# EAGLE design impulse (EAGLE 6.4)
AUTHOR: Brad Campbell; REV: B; TITLE: Impulse

## Sheet 1 of 2
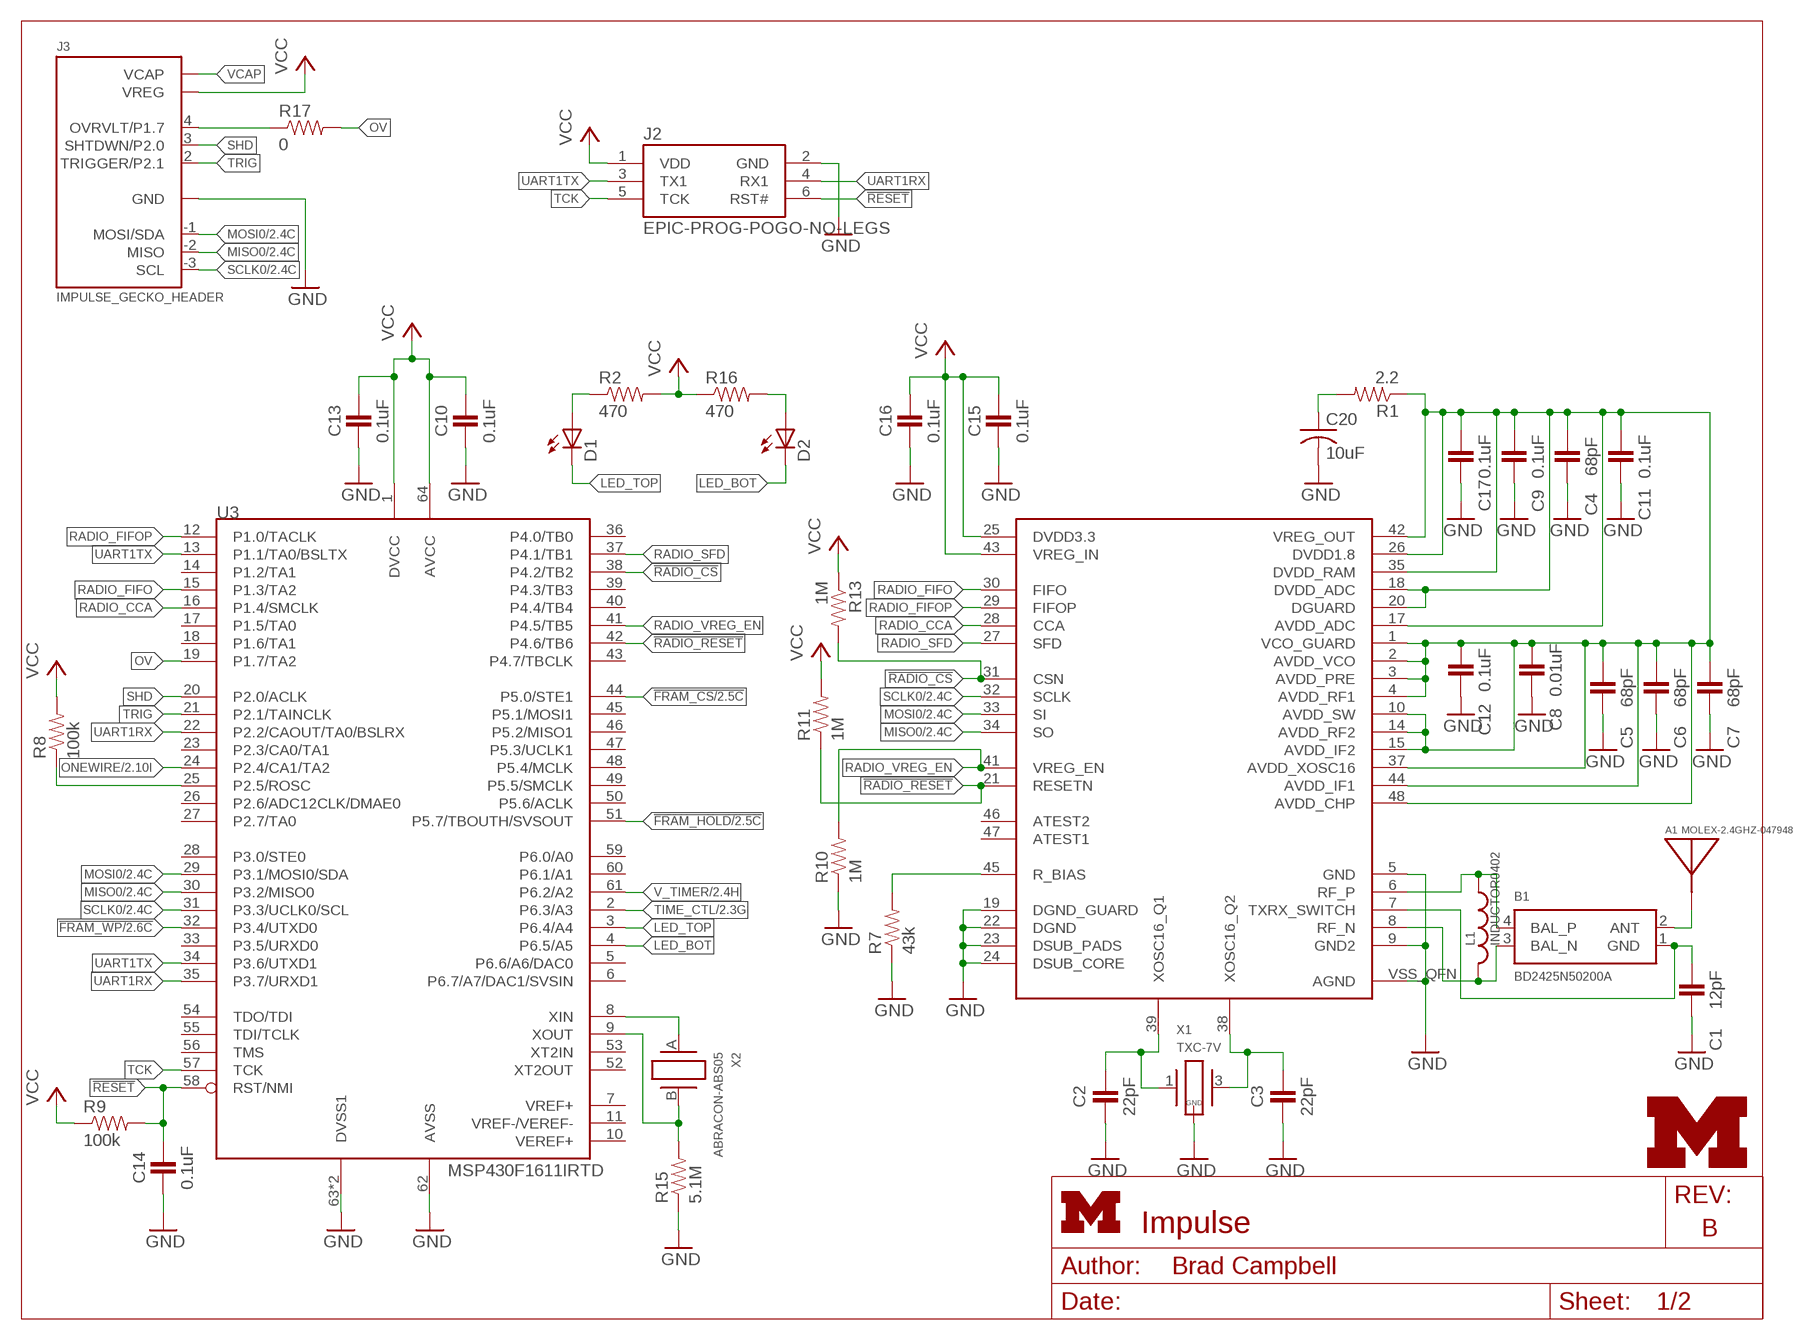
[diagram p0: schematic, sheet 1]
FRAME1 (LETTER_L): HEIGHT: 8.5in; WIDTH: 11in

### Parts
A1  MOLEX-2.4GHZ-047948  [MOLEX-47948-ANTENNA]
B1  BD2425N50200A  [BD2425N50200A]
C1  12pF  CAPACITOR  [0402_CAP]
C2  22pF  CAPACITOR  [0402_CAP]
C3  22pF  CAPACITOR  [0402_CAP]
C4  68pF  CAPACITOR  [0402_CAP]
C5  68pF  CAPACITOR  [0402_CAP]
C6  68pF  CAPACITOR  [0402_CAP]
C7  68pF  CAPACITOR  [0402_CAP]
C8  0.01uF  CAPACITOR  [0402_CAP]
C9  0.1uF  CAPACITOR  [0402_CAP]
C10  0.1uF  CAPACITOR  [0402_CAP]
C11  0.1uF  CAPACITOR  [0402_CAP]
C12  0.1uF  CAPACITOR  [0402_CAP]
C13  0.1uF  CAPACITOR  [0402_CAP]
C14  0.1uF  CAPACITOR  [0402_CAP]
C15  0.1uF  CAPACITOR  [0402_CAP]
C16  0.1uF  CAPACITOR  [0402_CAP]
C17  0.1uF  CAPACITOR  [0402_CAP]
C20  10uF  C-USC0805  [C0805]
D1  LED0603  [LED-0603]
D2  LED0603  [LED-0603]
J2  EPIC-PROG-POGO-NO-LEGS  [TC2030-IDC-NL]
J3  IMPULSE_GECKO_HEADER  [HEADER1X9/0.05IN]
L1  INDUCTOR0402  [0402_CAP]
R1  2.2  RESISTOR  [0402_RES]
R2  470  RESISTOR  [0402_RES]
R7  43k  RESISTOR  [0402_RES]
R8  100k  RESISTOR  [0402_RES]
R9  100k  RESISTOR  [0402_RES]
R10  1M  RESISTOR  [0402_RES]
R11  1M  RESISTOR  [0402_RES]
R13  1M  RESISTOR  [0402_RES]
R15  5.1M  RESISTOR  [0402_RES]
R16  470  RESISTOR  [0402_RES]
R17  0  RESISTOR  [0402_RES]
U3  MSP430F1611IRTD  [S-PVQFN-N64]
U4  CC2420RGZ  [S-PVQFN-N48]
U$1  UMICH_SOLID_SMALL  [UMICH_SOLID_75MIL]
X1  TXC-7V  [TXC-7V]
X2  ABRACON-ABS05  [ABS05]

### Nets
!FRAM_CS: U3.44(P5.0/STE1) ; also sheet 2
!FRAM_HOLD: U3.51(P5.7/TBOUTH/SVSOUT) ; also sheet 2
!FRAM_WP: U3.32(P3.4/UTXD0) ; also sheet 2
!RADIO_CS: R13.2 U3.38(P4.2/TB2) U4.31(CSN)
!RADIO_RESET: R11.1 U3.42(P4.6/TB6) U4.21(RESETN)
!RESET: C14.1 J2.6(RST#) R9.2 U3.58(RST/NMI)
GND: C1.2 C2.2 C3.2 C4.2 C5.2 C6.2 C7.2 C8.2 C9.2 C10.2 C11.2 C12.2 C13.2 C14.2 C15.2 C16.2 C17.2 C20.2 J2.2(GND) J3.0(GND) R7.1 R10.1 R15.1 U3.62(AVSS) U3.63(DVSS1) U3.GND(DVSS1) U4.5(GND) U4.9(GND2) U4.19(DGND_GUARD) U4.22(DGND) U4.23(DSUB_PADS) U4.24(DSUB_CORE) U4.VSS_QFN(AGND) X1.2(GND) X1.4(GND) ; also sheet 2
LED_BOT: D2.C U3.4(P6.5/A5)
LED_TOP: D1.C U3.3(P6.4/A4)
MISO0: J3.-2(MISO) U3.30(P3.2/MISO0) U4.34(SO) ; also sheet 2
MOSI0: J3.-1(MOSI/SDA) U3.29(P3.1/MOSI0/SDA) U4.33(SI) ; also sheet 2
N$1: R8.1 U3.25(P2.5/ROSC)
N$5: R7.2 U4.45(R_BIAS)
N$6: D1.A R2.1
N$7: C20.1 R1.2
N$8: C4.1 C5.1 C6.1 C7.1 C8.1 C9.1 C11.1 C12.1 C17.1 R1.1 U4.1(VCO_GUARD) U4.2(AVDD_VCO) U4.3(AVDD_PRE) U4.4(AVDD_RF1) U4.10(AVDD_SW) U4.14(AVDD_RF2) U4.15(AVDD_IF2) U4.17(AVDD_ADC) U4.18(DVDD_ADC) U4.20(DGUARD) U4.26(DVDD1.8) U4.35(DVDD_RAM) U4.37(AVDD_XOSC16) U4.42(VREG_OUT) U4.44(AVDD_IF1) U4.48(AVDD_CHP)
N$9: D2.A R16.2
N$12: B1.1(GND) C1.1 U4.7(TXRX_SWITCH)
N$17: B1.3(BAL_N) L1.2 U4.8(RF_N)
N$18: B1.4(BAL_P) L1.1 U4.6(RF_P)
N$19: C3.1 U4.38(XOSC16_Q2) X1.3
N$20: C2.1 U4.39(XOSC16_Q1) X1.1
ONEWIRE: U3.24(P2.4/CA1/TA2) ; also sheet 2
OV: R17.2 U3.19(P1.7/TA2)
OV-HEADER: J3.4(OVRVLT/P1.7) R17.1
RADIO_CCA: U3.16(P1.4/SMCLK) U4.28(CCA)
RADIO_FIFO: U3.15(P1.3/TA2) U4.30(FIFO)
RADIO_FIFOP: U3.12(P1.0/TACLK) U4.29(FIFOP)
RADIO_SFD: U3.37(P4.1/TB1) U4.27(SFD)
RADIO_VREG_EN: R10.2 U3.41(P4.5/TB5) U4.41(VREG_EN)
SCLK0: J3.-3(SCL) U3.31(P3.3/UCLK0/SCL) U4.32(SCLK) ; also sheet 2
SHD: J3.3(SHTDWN/P2.0) U3.20(P2.0/ACLK)
TCK: J2.5(TCK) U3.57(TCK)
TIME_CTL: U3.2(P6.3/A3) ; also sheet 2
TRIG: J3.2(TRIGGER/P2.1) U3.21(P2.1/TAINCLK)
UART1RX: J2.4(RX1) U3.22(P2.2/CAOUT/TA0/BSLRX) U3.35(P3.7/URXD1)
UART1TX: J2.3(TX1) U3.13(P1.1/TA0/BSLTX) U3.34(P3.6/UTXD1)
UNBAL: A1.1(ANTENNA) B1.2(ANT)
V_TIMER: U3.61(P6.2/A2) ; also sheet 2
VCAP: J3.5(VCAP)
VCC: C10.1 C13.1 C15.1 C16.1 J2.1(VDD) J3.1(VREG) R2.2 R8.2 R9.1 R11.2 R13.1 R16.1 U3.1(DVCC) U3.64(AVCC) U4.25(DVDD3.3) U4.43(VREG_IN) ; also sheet 2
XIN: U3.8(XIN) X2.A
XOUT: R15.2 U3.9(XOUT) X2.B
Unconnected: U3.5(P6.6/A6/DAC0) U3.6(P6.7/A7/DAC1/SVSIN) U3.7(VREF+) U3.10(VEREF+) U3.11(VREF-/VEREF-) U3.14(P1.2/TA1) U3.17(P1.5/TA0) U3.18(P1.6/TA1) U3.23(P2.3/CA0/TA1) U3.26(P2.6/ADC12CLK/DMAE0) U3.27(P2.7/TA0) U3.28(P3.0/STE0) U3.33(P3.5/URXD0) U3.36(P4.0/TB0) U3.39(P4.3/TB3) U3.40(P4.4/TB4) U3.43(P4.7/TBCLK) U3.45(P5.1/MOSI1) U3.46(P5.2/MISO1) U3.47(P5.3/UCLK1) U3.48(P5.4/MCLK) U3.49(P5.5/SMCLK) U3.50(P5.6/ACLK) U3.52(XT2OUT) U3.53(XT2IN) U3.54(TDO/TDI) U3.55(TDI/TCLK) U3.56(TMS) U3.59(P6.0/A0) U3.60(P6.1/A1) U4.46(ATEST2) U4.47(ATEST1)

## Sheet 2 of 2
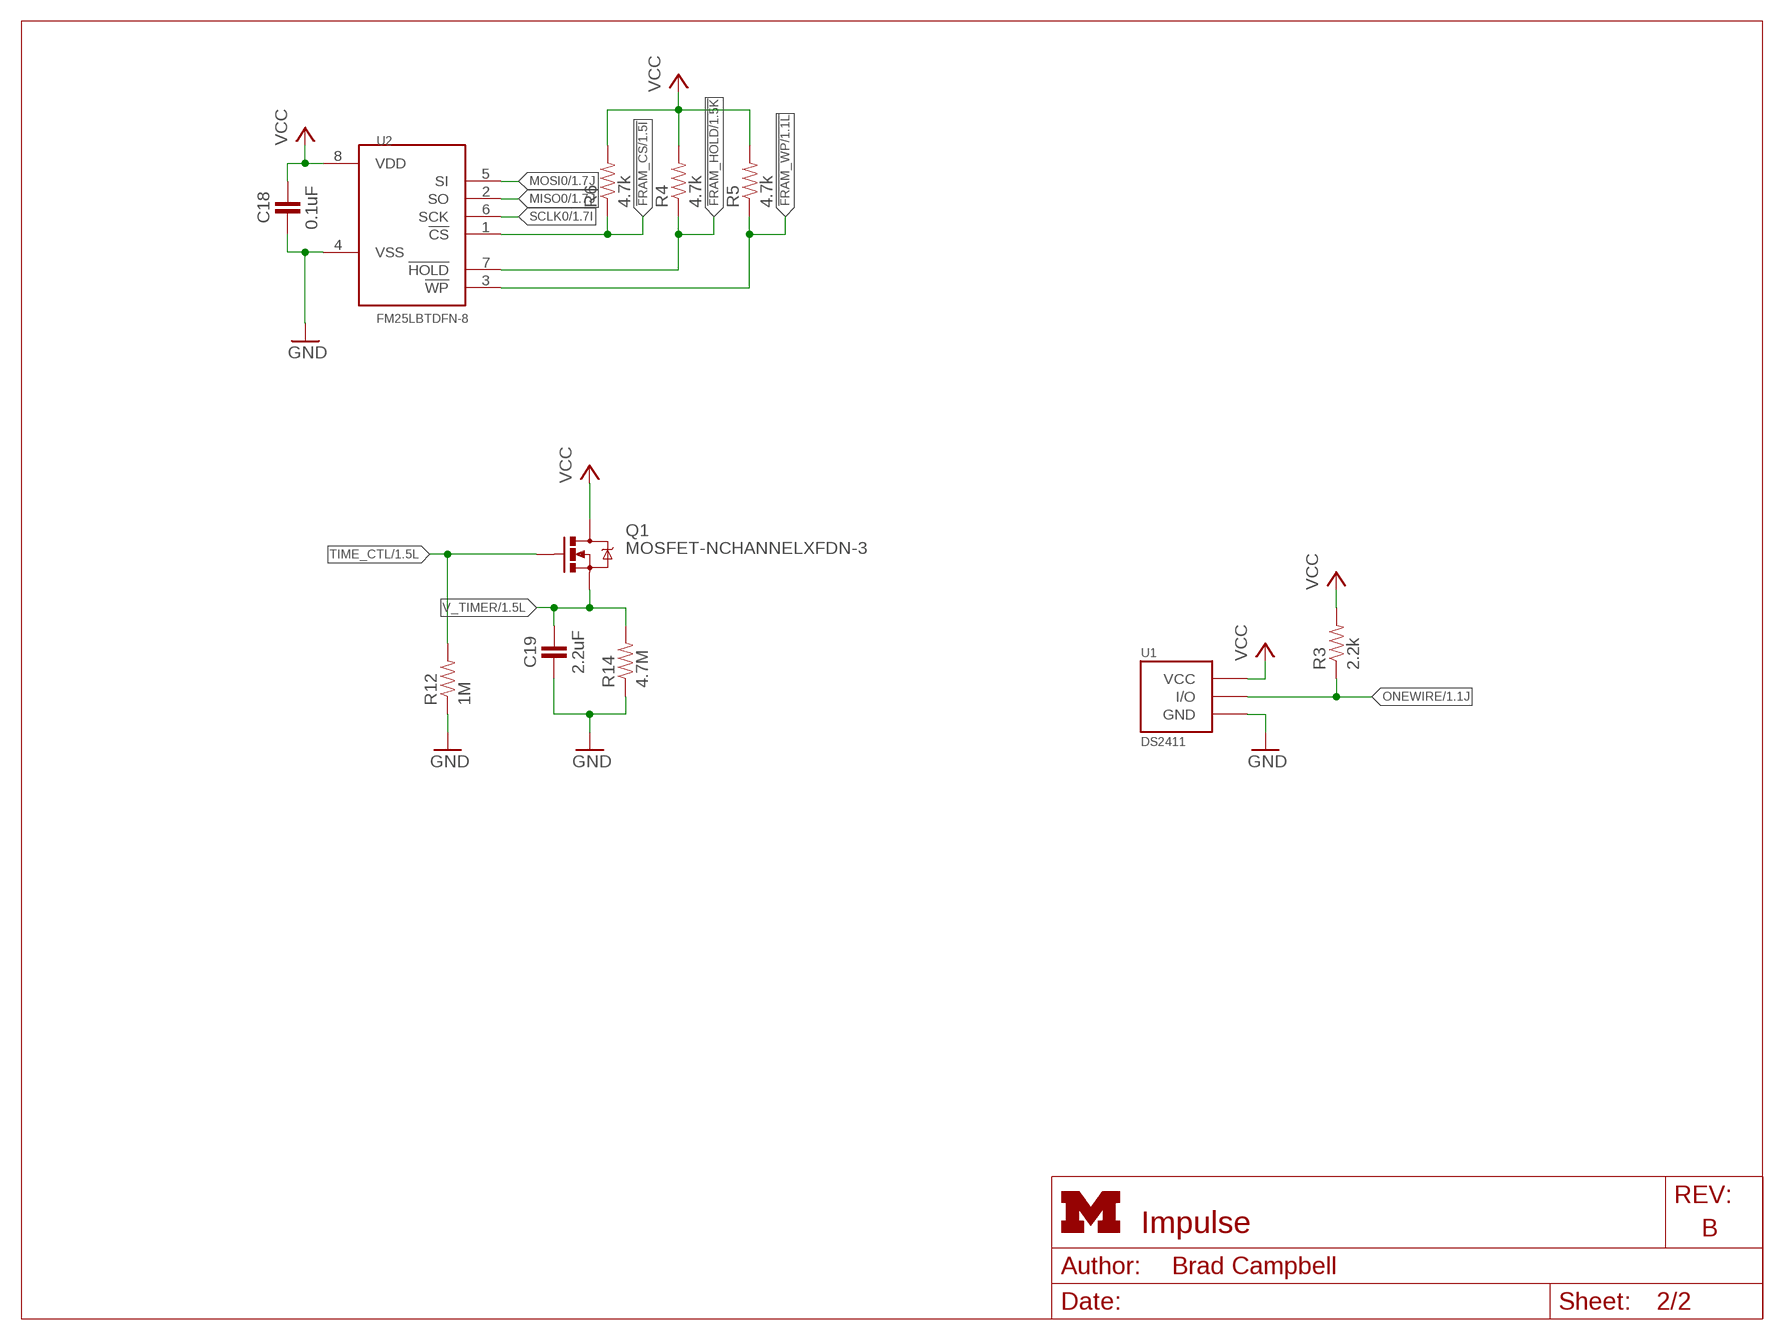
[diagram p1: schematic, sheet 2]
FRAME2 (LETTER_L): HEIGHT: 8.5in; WIDTH: 11in

### Parts
C18  0.1uF  CAPACITOR  [0402_CAP]
C19  2.2uF  CAPACITOR  [0402_CAP]
Q1  MOSFET-NCHANNELXFDN-3  [XFDFN-3]
R3  2.2k  RESISTOR  [0402_RES]
R4  4.7k  RESISTOR  [0402_RES]
R5  4.7k  RESISTOR  [0402_RES]
R6  4.7k  RESISTOR  [0402_RES]
R12  1M  RESISTOR  [0402_RES]
R14  4.7M  RESISTOR  [0402_RES]
U1  DS2411  [SOT-23]
U2  FM25LBTDFN-8  [TDFN-8]

### Nets
!FRAM_CS: R6.1 U2.1(!CS) ; also sheet 1
!FRAM_HOLD: R4.1 U2.7(!HOLD) ; also sheet 1
!FRAM_WP: R5.1 U2.3(!WP) ; also sheet 1
GND: C18.2 C19.2 R12.1 R14.1 U1.3(GND) U2.4(VSS) ; also sheet 1
MISO0: U2.2(SO) ; also sheet 1
MOSI0: U2.5(SI) ; also sheet 1
ONEWIRE: R3.1 U1.1(I/O) ; also sheet 1
SCLK0: U2.6(SCK) ; also sheet 1
TIME_CTL: Q1.G R12.2 ; also sheet 1
V_TIMER: C19.1 Q1.S R14.2 ; also sheet 1
VCC: C18.1 Q1.D R3.2 R4.2 R5.2 R6.2 U1.2(VCC) U2.8(VDD) ; also sheet 1

## Library data of the parts
A1 = chips:MOLEX-2.4GHZ-047948; DIGIKEY: WM4893CT-ND
B1 = chips:BD2425N50200A; DIGIKEY: 1173-1063-1-ND
C1-C19 = passives:CAPACITOR: 0402 Capacitor
C20 = rcl:C-US: CAPACITOR, American symbol; DIGIKEY: 478-2561-1-ND
D1 D2 = SparkFun-LED:LED: LEDs Standard schematic elements and footprints for 5mm, 3mm, 1206, and 0603 sized LEDs. 5mm - Spark Fun Electronics SKU : COM-00529 (and others)
J2 = epic:EPIC-PROG-POGO: Epic programmer based on the Tag Connect pogo pin cable.; TAG-CONNECT: TC2030-IDC-NL
J3 = gecko:IMPULSE_GECKO_HEADER: Header on the impulse EPIC-esque board.
L1 = passives:INDUCTOR; DIGIKEY: 712-1419-1-ND
Q1 = fets:MOSFET-NCHANNEL: Generic NMOS footprint; DIGIKEY: DMN2400UFB4-7DICT-ND
R1-R17 = passives:RESISTOR: Resistor Basic schematic elements and footprints for 0603, 1206, and PTH resistors.
U1 = chips:DS2411: Maxim DS2411 Silicon Serial Number with VCC Input; DIGIKEY: DS2411R+CT-ND
U2 = chips:FM25LB: IC FRAM 4KBIT 10MHZ 8SOIC; DIGIKEY: FM25L04B-DGRA-ND; MOUSER: 877-FM25L04B-DG
U3 = chips:MSP430F1611; DIGIKEY: 296-18102-1-ND
U4 = chips:CC2420: 2.4 GHz IEEE 802.15.4 / ZigBee-ready RF Transceiver; DIGIKEY: 296-19585-1-ND
U$1 = logos:UMICH_SOLID
X1 = crystals:TXC-7V
X2 = crystals:ABRACON-ABS05: • Smallest 32.768KHz package available • 0.5mm height ideal for high density circuit boards • Ceramic package offers excellent environmental & heat resistance • Extended temperature -40°C to +85°C for industrial applications; DIGIKEY: 535-11899-1-ND

## Board
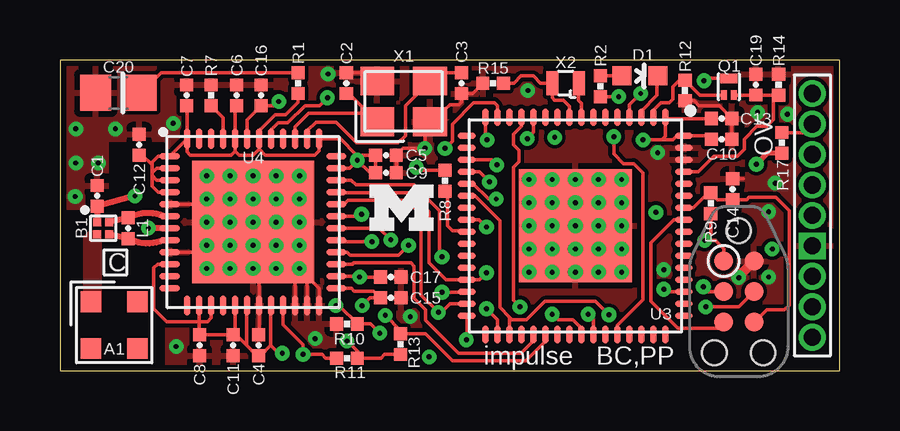
[diagram p2: board, top side]
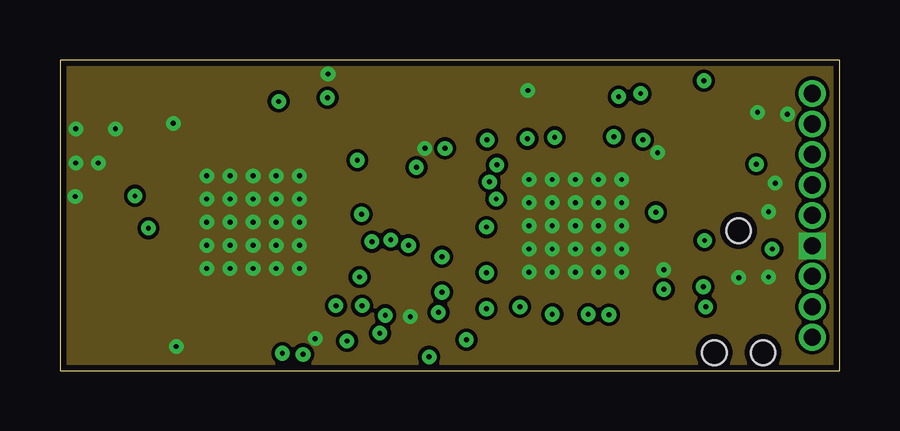
[diagram p3: board, inner layer Route2]
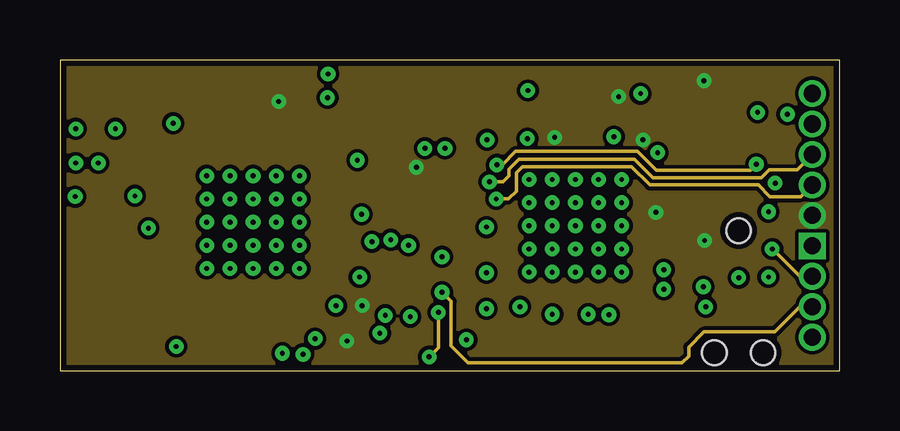
[diagram p4: board, inner layer Route15]
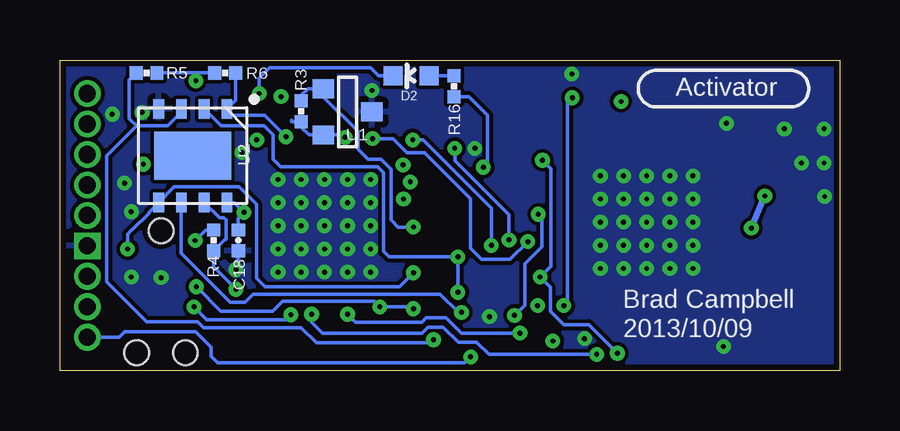
[diagram p5: board, bottom side, seen from below]

Size 32.51 x 12.95 mm. Coordinates in mm from the lower left corner, seen from the top.
Outline: 0,0 32.51,0 32.51,12.95 0,12.95 0,0
Copper layers (1+2*15+16): Top 0.0178mm / dielectric 12mil / Route2 0.0356mm / dielectric 28mil / Route15 0.0356mm / dielectric 12mil / Bottom 0.0178mm
Design rules "sunstone-4lyr_v1.0.0.3 *": minimum track width 6mil, minimum drill 8mil, track to track 6mil, track to pad 6mil, pad to pad 6mil, via to via 6mil, smd to smd 6mil, copper to edge 10mil, drill to drill 16mil, minimum pad ring 8mil, minimum via ring 8mil, stop-mask expansion 3mil, vias tented up to drill 8mil, thermal gap 10mil
tRestrict: area 10,2.5 to 10.1,3; area 10.5,2.5 to 10.6,3; area 25.8,9 to 26.2,9.1

### Footprints (pad centres in the part's own frame; a part is rotated, then mirrored left to right if it is on the bottom)
MOLEX-47948-ANTENNA = smd 0.87 x 0.87: 1 0.97,0.97; 2 -0.97,0.97; 3 -0.97,-0.97; 4 0.97,-0.97
BD2425N50200A = smd 0.33 x 0.33: 1 0.254,0.254; 2 -0.254,0.254; 3 -0.254,-0.254; 4 0.254,-0.254
0402_CAP = smd 0.536 x 0.546: 1 -0.433,0; 2 0.433,0
C0805 = smd 1.3 x 1.5: 1 -0.95,0; 2 0.95,0
LED-0603 = smd 0.8 x 0.8: A 0,-0.75; C 0,0.75
TC2030-IDC-NL = smd 0.787 x 0.787: 1 -1.27,-0.635; 2 -1.27,0.635; 3 0,-0.635; 4 0,0.635; 5 1.27,-0.635; 6 1.27,0.635 | hole 1.016: -2.54,0; 2.54,1.016; 2.54,-1.016
HEADER1X9/0.05IN = drill 0.711 pad 1.016 square: 0 -1.27,0 | drill 0.711 pad 1.016: 1 0,0; 2 1.27,0; 3 2.54,0; 4 3.81,0; 5 5.08,0; -1 -2.54,0; -2 -3.81,0; -3 -5.08,0
XFDFN-3 = smd 0.4 x 0.7: D 0.35,0 | smd 0.4 x 0.25: G -0.35,0.215; S -0.35,-0.215
0402_RES = smd 0.536 x 0.546: 1 -0.433,0; 2 0.433,0
SOT-23 = smd 0.787 x 0.889: 1 0.991,1.016; 2 -0.94,1.016; 3 0.025,-1.016
TDFN-8 = smd 0.45 x 0.8: 1 -1.425,-1.95; 2 -0.475,-1.95; 3 0.475,-1.95; 4 1.425,-1.95; 5 1.425,1.95; 6 0.475,1.95; 7 -0.475,1.95; 8 -1.425,1.95 | smd 3.2 x 2: NC 0,0
S-PVQFN-N64 = smd 0.75 x 0.28: 1 -4.525,3.75; 2 -4.525,3.25; 3 -4.525,2.75; 4 -4.525,2.25; 5 -4.525,1.75; 6 -4.525,1.25; 7 -4.525,0.75; 8 -4.525,0.25; 9 -4.525,-0.25; 10 -4.525,-0.75; 11 -4.525,-1.25; 12 -4.525,-1.75; 13 -4.525,-2.25; 14 -4.525,-2.75; 15 -4.525,-3.25; 16 -4.525,-3.75; 33 4.525,-3.75; 34 4.525,-3.25; 35 4.525,-2.75; 36 4.525,-2.25; 37 4.525,-1.75; 38 4.525,-1.25; 39 4.525,-0.75; 40 4.525,-0.25; 41 4.525,0.25; 42 4.525,0.75; 43 4.525,1.25; 44 4.525,1.75; 45 4.525,2.25; 46 4.525,2.75; 47 4.525,3.25; 48 4.525,3.75 | smd 0.28 x 0.75: 17 -3.75,-4.525; 18 -3.25,-4.525; 19 -2.75,-4.525; 20 -2.25,-4.525; 21 -1.75,-4.525; 22 -1.25,-4.525; 23 -0.75,-4.525; 24 -0.25,-4.525; 25 0.25,-4.525; 26 0.75,-4.525; 27 1.25,-4.525; 28 1.75,-4.525; 29 2.25,-4.525; 30 2.75,-4.525; 31 3.25,-4.525; 32 3.75,-4.525; 49 3.75,4.525; 50 3.25,4.525; 51 2.75,4.525; 52 2.25,4.525; 53 1.75,4.525; 54 1.25,4.525; 55 0.75,4.525; 56 0.25,4.525; 57 -0.25,4.525; 58 -0.75,4.525; 59 -1.25,4.525; 60 -1.75,4.525; 61 -2.25,4.525; 62 -2.75,4.525; 63 -3.25,4.525; 64 -3.75,4.525 | smd 4.7 x 4.7: GND 0,0
S-PVQFN-N48 = smd 0.85 x 0.28: 1 -3.475,2.75; 2 -3.475,2.25; 3 -3.475,1.75; 4 -3.475,1.25; 5 -3.475,0.75; 6 -3.475,0.25; 7 -3.475,-0.25; 8 -3.475,-0.75; 9 -3.475,-1.25; 10 -3.475,-1.75; 11 -3.475,-2.25; 12 -3.475,-2.75; 25 3.475,-2.75; 26 3.475,-2.25; 27 3.475,-1.75; 28 3.475,-1.25; 29 3.475,-0.75; 30 3.475,-0.25; 31 3.475,0.25; 32 3.475,0.75; 33 3.475,1.25; 34 3.475,1.75; 35 3.475,2.25; 36 3.475,2.75 | smd 0.28 x 0.85: 13 -2.75,-3.475; 14 -2.25,-3.475; 15 -1.75,-3.475; 16 -1.25,-3.475; 17 -0.75,-3.475; 18 -0.25,-3.475; 19 0.25,-3.475; 20 0.75,-3.475; 21 1.25,-3.475; 22 1.75,-3.475; 23 2.25,-3.475; 24 2.75,-3.475; 37 2.75,3.475; 38 2.25,3.475; 39 1.75,3.475; 40 1.25,3.475; 41 0.75,3.475; 42 0.25,3.475; 43 -0.25,3.475; 44 -0.75,3.475; 45 -1.25,3.475; 46 -1.75,3.475; 47 -2.25,3.475; 48 -2.75,3.475 | smd 5.1 x 5.1: VSS_QFN 0,0
TXC-7V = smd 1.4 x 1.2: 1 -1.1,-0.85; 2 1.1,-0.85; 3 1.1,0.85; 4 -1.1,0.85
ABS05 = smd 0.5 x 1: A -0.55,0; B 0.55,0

### Placement (x,y rotation side)
A1  2.26,1.91 90 top
B1  1.8,5.94 90 top
C1  1.55,7.29 90 top
C2  11.94,11.99 90 top
C3  16.74,11.99 270 top
C4  8.28,1.07 90 top
C5  13.59,8.99 0 top
C6  7.37,11.48 90 top
C7  5.28,11.48 90 top
C8  5.82,1.07 270 top
C9  13.59,8.26 0 top
C10  27.58,9.65 0 top
C11  7.21,1.07 270 top
C12  3.3,9.42 90 top
C13  27.58,10.52 0 top
C14  28.04,7.57 90 top
C15  13.79,3.05 0 top
C16  8.38,11.48 90 top
C17  13.79,3.91 0 top
C18  25.07,5.44 270 bottom
C19  29,11.93 90 top
C20  2.44,11.58 180 top
D1  24.18,12.29 270 top
D2  17.88,12.29 90 bottom
J2  28.3,3.3 270 top
J3  31.37,6.48 90 top
L1  2.84,5.94 270 top
Q1  27.89,11.84 90 top
R1  9.93,11.99 90 top
R2  22.53,11.86 270 top
R3  22.45,10.82 270 bottom
R4  26.1,5.44 90 bottom
R5  28.91,12.41 0 bottom
R6  25.63,12.41 180 bottom
R7  6.3,11.48 270 top
R8  16.05,7.92 90 top
R9  27.13,6.99 90 top
R10  11.96,1.96 0 top
R11  11.96,0.53 0 top
R12  26.06,11.68 90 top
R13  14.2,1.12 90 top
R14  29.96,11.92 270 top
R15  18.06,11.99 0 top
R16  16.08,11.86 90 bottom
R17  30.1,9.5 270 top
U1  20.52,10.77 90 bottom
U2  26.98,8.97 180 bottom
U3  21.49,6.05 270 top
U4  8.05,6.2 0 top
U$1  12.9,5.84 0 top
X1  14.33,11.23 0 top
X2  21.08,11.99 180 top

### Tracks (layer width: path | path; a pad name or v marks a point on that pad's centre or on a via)
!FRAM_CS  (via drill 0.2)
  Top 0.152: U3.44 23.24,1.9 24.31,2.97 24.31,8.26 23.93,8.64 23.5,8.64 23.09,9.04 v23.09,9.75
  Bottom 0.152: v23.09,9.75 23.99,10.65 25.29,10.65 U2.1 25.2,11.27 R6.1
!FRAM_HOLD  (via drill 0.2)
  Top 0.152: U3.51 25.28,3.29 v25.17,3.4
  Bottom 0.152: 26.48,7.02 U2.7 25.86,6.38 25.68,6.38 25.59,6.29 25.59,5.49 25.62,5.49 R4.1 26.1,4.34 v25.17,3.4
!FRAM_WP  (via drill 0.2)
  Top 0.152: U3.32 16.96,1.32 v16.94,1.29
  Bottom 0.152: v16.94,1.29 17.07,1.17 21.82,1.17 22.45,1.8 26.52,1.8 26.77,2.06 28.91,2.06 30.56,3.71 30.56,8.97 29.31,10.21 | 29.31,10.21 28.02,10.21 27.45,10.78 U2.3 | R5.1 29.62,12.13 29.62,10.52 29.31,10.21
!RADIO_CS  (via drill 0.2)
  Top 0.152: 11.56,6.48 U4.31 12.49,6.45 v12.57,6.53 | U3.38 20.24,1.24 19.43,0.43 16.36,0.43 15.24,1.55 R13.2 14.2,1.68 v13.56,2.31
  Top 0.203: U4.31
  Bottom 0.152: v13.56,2.31 13.13,2.74 13.13,4.47 12.42,5.18 12.42,6.38 v12.57,6.53
!RADIO_RESET  (via drill 0.2)
  Top 0.152: U4.21 9.3,1.93 10.13,1.1 v10.13,0.69 10.92,0.69 11.07,0.53 R11.1 | U3.42 22.24,2.15 v22.02,2.36
  Bottom 0.152: v22.02,2.36 22.02,2.03 21.57,1.57 17.42,1.57 17.17,1.83 16.54,1.83 15.9,1.19 15.14,1.19 14.63,0.69 v10.13,0.69
!RESET
  Top 0.152: U3.58 26.4,6.79 27.03,7.42 R9.2 27.41,7.14 C14.1 | 28.07,7.11 C14.1 | J2.6 28.96,2.03 29.46,2.54 30.2,2.54 30.4,2.74 30.4,6.68 29.84,7.24 28.73,7.24 28.63,7.14 C14.1
GND  (via drill 0.2)
  Top 0.152: U4.9 6.8,4.95 U4.VSS_QFN | U4.5 7.3,6.95 U4.VSS_QFN | U4.VSS_QFN 7.62,5.77 7.62,5.08 8.3,4.4 U4.19 8.3,1.5 | U4.22 9.8,4.09 v9.98,4.27 | U4.23 10.3,3.95 v9.98,4.27 | U4.24 10.8,3.45 v9.98,4.27 | X1.4 12.88,12.42 C2.2 | C9.2 C5.2 14.3,9.27 v15.21,9.27 15.21,10.17 X1.2 15.92,10.87 16.03,10.87 16.26,11.1 16.64,11.1 16.74,11.2 C3.2 17.19,11.56 R15.1 | C10.2 C13.2 27.48,11.05 26.64,11.05 26.44,11.25 R12.1 | 28.48,8 C14.2
  Top 0.406: v28.3,3.89 28.3,3.94 J2.2
  Bottom 0.152: v25.17,4.22 25.07,4.31 C18.2
  other vias: 21.49,6.05 22.45,6.05 23.42,6.05 21.49,7.01 21.49,7.98 22.45,7.98 22.45,7.01 23.42,7.01 23.42,7.98 23.42,5.08 23.42,4.11 22.45,4.11 22.45,5.08 21.49,5.08 21.49,4.11 20.52,4.11 20.52,5.08 20.52,6.05 20.52,7.01 20.52,7.98 19.56,7.98 19.56,7.01 19.56,6.05 19.56,5.08 19.56,4.11 24.92,9.09 29.54,3.91 30.33,10.69 29.08,10.77 19.51,11.68 8.05,6.2 9.02,6.2 9.98,6.2 9.98,7.16 9.02,7.16 8.05,7.16 7.09,7.16 6.12,7.16 6.12,6.2 7.09,6.2 7.09,5.23 7.09,4.27 9.02,4.27 8.05,4.27 8.05,5.23 9.02,5.23 9.98,5.23 6.12,4.27 6.12,5.23 6.12,8.13 7.09,8.13 8.05,8.13 9.98,8.13 9.02,8.13 4.85,1.02 4.72,10.31 11.18,12.37 10.64,1.35 0.64,7.26 0.66,8.66 1.6,8.66 2.31,10.08 0.66,10.08 14.61,2.26 29.54,6.63 29.82,7.82
  pour Top: 33.02,13.72 33.02,-0.51 4.5,-0.51 4.5,9.63 1.93,9.63 1.93,7.32 0.94,7.32 0.94,6.81 -0.56,6.81 -0.56,13.72
  pour Bottom: -0.56,13.72 33.02,13.72 33.02,-0.51 -0.56,-0.51
  pour Route2 (no thermals): -0.66,14.22 33.53,14.22 33.53,-1.02 -0.66,-1.02
LED_BOT  (via drill 0.2)
  Top 0.152: U3.4 23.74,11.09 v24.21,11.56
  Bottom 0.152: v24.21,11.56 24.21,12.19 23.77,12.62 19.56,12.62 19.23,12.29 D2.C
LED_TOP
  Top 0.152: U3.3 24.24,10.83 24.89,11.48 24.89,12.26 D1.C
MISO0  (via drill 0.2)
  Top 0.152: v15.93,3.28 16.95,3.28 U3.30 | U4.34 12.14,7.95 12.34,7.75 14.76,7.75 15.82,6.68 15.82,4.85 v15.93,4.75
  Route15 0.152: J3.-2 30.84,2.67 29.79,1.63 26.85,1.63 26.21,0.99 26.21,0.61 25.93,0.33 17.02,0.33 16.31,1.04 16.31,2.9 v15.93,3.28
  Bottom 0.152: v15.93,3.28 v15.93,4.75 18.8,4.75 19.02,4.98 19.02,8.26 19.28,8.51 23.32,8.51 23.62,8.81 23.62,9.83 24,10.21 25.8,10.21 U2.2
MOSI0  (via drill 0.2)
  Top 0.152: U4.33 11.56,7.42 14.61,7.42 15.39,6.63 15.39,4.5 16.09,3.79 U3.29 17.49,3.79 v17.78,4.09
  Route15 0.152: J3.-1 30.84,3.94 v29.69,5.08
  Bottom 0.152: v17.78,4.09 18.36,3.5 23.95,3.5 24.31,3.86 24.31,6.93 25.04,7.67 27.75,7.67 U2.5 28.8,6.61 28.8,6.58 29.51,5.88 29.52,5.88 29.69,5.7 v29.69,5.08
N$1
  Top 0.152: U3.25 16.92,5.84 16.36,5.84 16.15,6.04 16.15,7.39 R8.1
N$5
  Top 0.152: R7.2 6.8,10.54 U4.45
N$6
  Top 0.152: R2.1 D1.A
N$7
  Top 0.152: R1.2 4.23,12.42 C20.1
N$8  (via drill 0.2)
  Top 0.152: 5.8,1.5 5.8,2.06 | 5.8,2.06 U4.14 | C6.1 7.3,10.98 U4.44 | 3.83,8.59 3.83,8.69 4.1,8.95 U4.1 U4.48 | 3.83,8.59 3.83,8.26 | 3.83,8.26 3.83,8.15 | 3.83,8.15 3.83,7.7 4.09,7.44 U4.4 | U4.3 4.04,7.95 3.83,8.15 | U4.2 4.03,8.45 3.83,8.26 | C12.1 3.43,8.99 3.83,8.59 | U4.10 4.07,4.45 3.91,4.29 3.91,2.59 4.45,2.06 5.8,2.06 | U4.15 6.3,2.21 6.15,2.06 5.8,2.06 | 8.79,1.07 8.79,2.71 U4.20 | 7.77,1.07 7.77,2.69 U4.18 | C11.1 7.3,1.59 U4.17 | C11.1 C8.1 | C11.1 7.34,1.5 7.77,1.07 | C17.1 v12.5,3.91 12.46,3.95 U4.26 | 8.38,0.74 C4.1 | U4.42 8.3,9.25 8.56,8.99 10.62,8.99 10.8,9.18 U4.37 11.69,9.67 12.37,8.99 | U4.42 8.3,9.24 8.05,8.99 7.47,8.99 7.3,9.16 U4.44 | R1.1 9.93,11.2 9.4,10.67 8.97,10.67 8.3,10 U4.42 | U4.44 7.3,9.16 7.14,8.99 5.44,8.99 5.3,9.12 U4.48 | v12.39,8.78 12.92,8.26 C9.1 C5.1 12.37,8.99 | U4.35 12.06,8.45 v12.39,8.78 | 12.37,8.99 12.39,8.97 v12.39,8.78 | v9.27,0.74 9.12,0.74 8.79,1.07 | C4.1 8.36,0.63 8.79,1.07 | C4.1 8.21,0.63 7.77,1.07 | U4.48 5.3,11.03 C7.1
  Top 0.203: C8.1 5.8,1.5 | 7.32,2.71 U4.17
  Bottom 0.152: v9.27,0.74 10.46,1.93 11.51,1.93 12.06,2.49 12.06,3.48 v12.5,3.91 12.04,4.37 12.04,8.42 v12.39,8.78
N$9
  Bottom 0.152: D2.A R16.2
N$12  (via drill 0.2)
  Top 0.254: U4.7 v3.69,5.95 | v3.12,7.29 C1.1 B1.1
  Bottom 0.254: v3.69,5.95 v3.12,7.29
N$17
  Top 0.254: B1.3 L1.2 arc50 4.32,5.45 U4.8
N$18
  Top 0.254: B1.4 L1.1 arc-50 4.32,6.45 U4.6
N$19
  Top 0.152: C3.1 15.77,12.42 X1.3 14.4,11.05 14.4,9.8 14.1,9.5 12.37,9.5 11.51,10.36 10.67,10.36 10.3,10 U4.38
N$20
  Top 0.152: C2.1 12.05,11.56 X1.1 12.86,10.74 10.36,10.74 9.8,10.18 U4.39
ONEWIRE  (via drill 0.2)
  Top 0.152: U3.24 17.48,6.3 v17.78,5.99
  Bottom 0.152: v17.78,5.99 18.41,5.99 18.72,6.3 18.72,8.41 19.13,8.81 19.66,8.81 20.09,9.25 20.09,9.98 21.54,11.43 U1.1 22.17,11.76 22.45,11.48 R3.1
OV  (via drill 0.2)
  Top 0.152: R17.2 | U3.19 18,8.79 v18.21,8.59
  Top 0.203: R17.2 29.49,9.07 v29.03,8.61
  Route15 0.152: v18.21,8.59 18.44,8.59 19,9.14 24.08,9.14 24.87,8.36 28.78,8.36 v29.03,8.61
OV-HEADER
  Top 0.152: R17.1 31.02,9.93 J3.4
RADIO_CCA  (via drill 0.2)
  Top 0.152: U4.28 11.97,4.95 12.09,4.83 14.12,4.83 v14.53,5.23 | U3.16 17.74,9.69 v17.8,9.63
  Bottom 0.152: v17.8,9.63 17.37,9.63 14.53,6.78 v14.53,5.23
RADIO_FIFO  (via drill 0.2)
  Top 0.152: U4.30 13.31,5.95 v13.79,5.46 | U3.15 18.24,11.05 18.11,11.18 17.25,11.18 16.36,10.29 16.36,9.58 v16.05,9.27
  Bottom 0.152: v16.05,9.27 16.05,8.76 13.79,6.5 v13.79,5.46
RADIO_FIFOP  (via drill 0.2)
  Top 0.152: U4.29 11.59,5.38 v13.01,5.38 | U3.12 19.74,9.93 v19.48,9.68
  Bottom 0.152: v19.48,9.68 18.62,9.68 18.03,9.09 17.32,9.09 15.39,7.16 15.39,5.11 14.94,4.65 13.74,4.65 v13.01,5.38
RADIO_SFD
  Top 0.152: U3.37 19.74,1.25 19.23,0.74 16.61,0.74 15.24,2.11 15.24,2.54 14.76,3.02 14.76,4.37 14.63,4.5 12.24,4.5 12.19,4.45 U4.27
RADIO_VREG_EN  (via drill 0.2)
  Top 0.152: U3.41 21.74,1.78 21.39,2.13 20.75,2.13 v20.52,2.36 | U4.41 8.8,10.05 9.09,10.34 9.5,10.34 10.21,11.05 10.82,11.05 v11.15,11.38 | v13.34,1.57 12.95,1.96 R10.2 11.63,2.72 v11.51,2.72
  Bottom 0.152: v11.15,11.38 11.35,11.18 11.35,2.87 v11.51,2.72 11.51,2.69 | v20.52,2.36 20.19,2.03 17.42,2.03 17.25,2.21 16.41,2.21 15.77,1.57 v13.34,1.57
SCLK0  (via drill 0.2)
  Top 0.152: U4.32 11.85,6.95 12.01,7.11 14.45,7.11 15.06,6.5 15.06,3.15 v15.77,2.44 15.9,2.44 16.26,2.79 U3.31
  Route15 0.152: v15.77,2.44 15.77,0.96 v15.39,0.58
  Bottom 0.152: v15.77,2.44 15.9,2.44 16.66,3.2 24.46,3.2 24.79,2.87 25.43,2.87 27.45,4.89 U2.6 | J3.-3 30.05,1.4 29.82,1.63 26.85,1.63 26.21,0.99 26.21,0.61 25.93,0.33 15.65,0.33 v15.39,0.58
SHD  (via drill 0.2)
  Top 0.152: U3.20 17.49,8.29 v17.91,7.87
  Route15 0.152: v17.91,7.87 18.47,7.87 18.72,8.13 18.72,8.41 19.13,8.81 23.95,8.81 24.71,8.05 29.23,8.05 29.57,8.38 30.73,8.38 J3.3
TCK
  Top 0.152: U3.57 25.6,6.29 24.64,5.33 24.64,2.9 25.76,1.78 27.41,1.78 J2.5
TIME_CTL
  Top 0.152: Q1.G 26.69,11.49 R12.2 25.83,12.12 25.55,11.84 25.55,11.33 25.4,11.18 25.04,11.18 24.74,10.87 U3.2
TRIG  (via drill 0.2)
  Top 0.152: v18.19,7.16 17.86,7.16 17.22,7.79 U3.21
  Route15 0.152: v18.19,7.16 18.69,7.16 19.02,7.49 19.02,8.26 19.28,8.51 23.82,8.51 24.59,7.75 29.11,7.75 29.59,7.26 30.89,7.26 J3.2
UART1RX  (via drill 0.2)
  Top 0.152: 18.74,2.24 U3.35 | J2.4 28.3,2.67 v26.92,2.67 | 18.74,2.24 18.34,2.64 18.34,6.25 17.29,7.29 U3.22 | v22.89,2.34 22.33,2.9 20.22,2.9 19.46,2.13 18.85,2.13 18.74,2.24
  Bottom 0.152: v26.92,2.67 26.39,2.13 23.09,2.13 v22.89,2.34
UART1TX  (via drill 0.2)
  Top 0.152: U3.34 18.24,2.13 v17.78,2.59 | U3.13 19.24,10.2 18.9,9.86 18.9,9.42 19.13,9.2 19.13,8.71 18.9,8.48 18.9,2.95 v19.18,2.67 | J2.3 27.03,3.3 v26.82,3.5
  Bottom 0.152: v17.78,2.59 17.86,2.67 v19.18,2.67 19.41,2.9 23.24,2.9 23.65,2.49 25.81,2.49 v26.82,3.5
UNBAL
  pour Top (no thermals): 1.74,5.88 1.74,2.44 0.98,2.44 0.98,5.59 1.27,5.88
V_TIMER
  Top 0.152: C19.1 | C19.1 R14.2 29.74,11.28 29.74,10.46 29.46,10.19 29.06,10.19 28.52,9.65 28.52,9.25 28.23,8.95 27.27,8.95 26.61,8.29 U3.61 | C19.1 Q1.S
VCC  (via drill 0.2)
  Top 0.152: U4.43 7.8,10.47 C16.1 8.94,11.05 v9.12,11.23 | R8.2 14.98,8.36 v14.86,8.48 | U4.25 12.15,3.45 12.27,3.33 13.08,3.33 C15.1 12.93,3.05 v12.6,2.72 | 25.09,9.63 25.55,9.63 25.72,9.79 U3.64 27.01,9.79 C10.1 | 25.09,9.63 v24.31,9.63 | 25.09,9.63 25.24,9.77 U3.1 25.29,10.52 C13.1 | 27.94,4.57 J2.1 27.69,4.6 27.69,5.08 27.33,5.44 v26.87,5.44 27.13,5.69 R9.1 | Q1.D 26.95,12.19 v26.85,12.09 | v11.96,1.25 12.4,0.81 R11.2 13.39,0.53 13.54,0.69 R13.1 | R2.2 v23.29,11.43
  Bottom 0.152: 22.86,10.39 22.86,10.44 22.81,10.39 R3.2 22.45,10.16 22.13,9.83 U1.2 20.73,9.83 v20.62,9.73 | R6.2 26.92,12.41 | 26.92,12.41 R5.2 | v26.85,12.09 26.85,12.34 26.92,12.41 | R4.2 26.44,5.87 v26.87,5.44 | C18.1 25.07,6.37 v24.84,6.6 25.25,7.02 U2.8 | R16.1 15.47,11.43 14.68,10.64 14.68,8.66 v14.86,8.48
  pour Route15 (no thermals): -0.66,13.72 33.53,13.72 33.53,-1.02 -0.66,-1.02
XIN
  Top 0.152: U3.8 21.74,11.15 21.61,11.28 21.61,11.97 X2.A
XOUT
  Top 0.152: R15.2 18.92,11.99 19.23,12.29 19.74,12.29 20.04,11.99 X2.B 20.52,11.38 20.62,11.28 20.98,11.28 21.24,11.02 U3.9

### Text on the board
tPlace: OV | C | impulse | BC,PP
bPlace: Activator | Brad Campbell | 2013/10/09
tDocu: VCAP | OVERVOLT | SHUTDOWN | TRIGGER | VREG | GND | MOSI | MISO | SCL